# EAGLE schematic 68EC020TK-V02 (EAGLE 6.6.0)

## Sheet 1 of 4
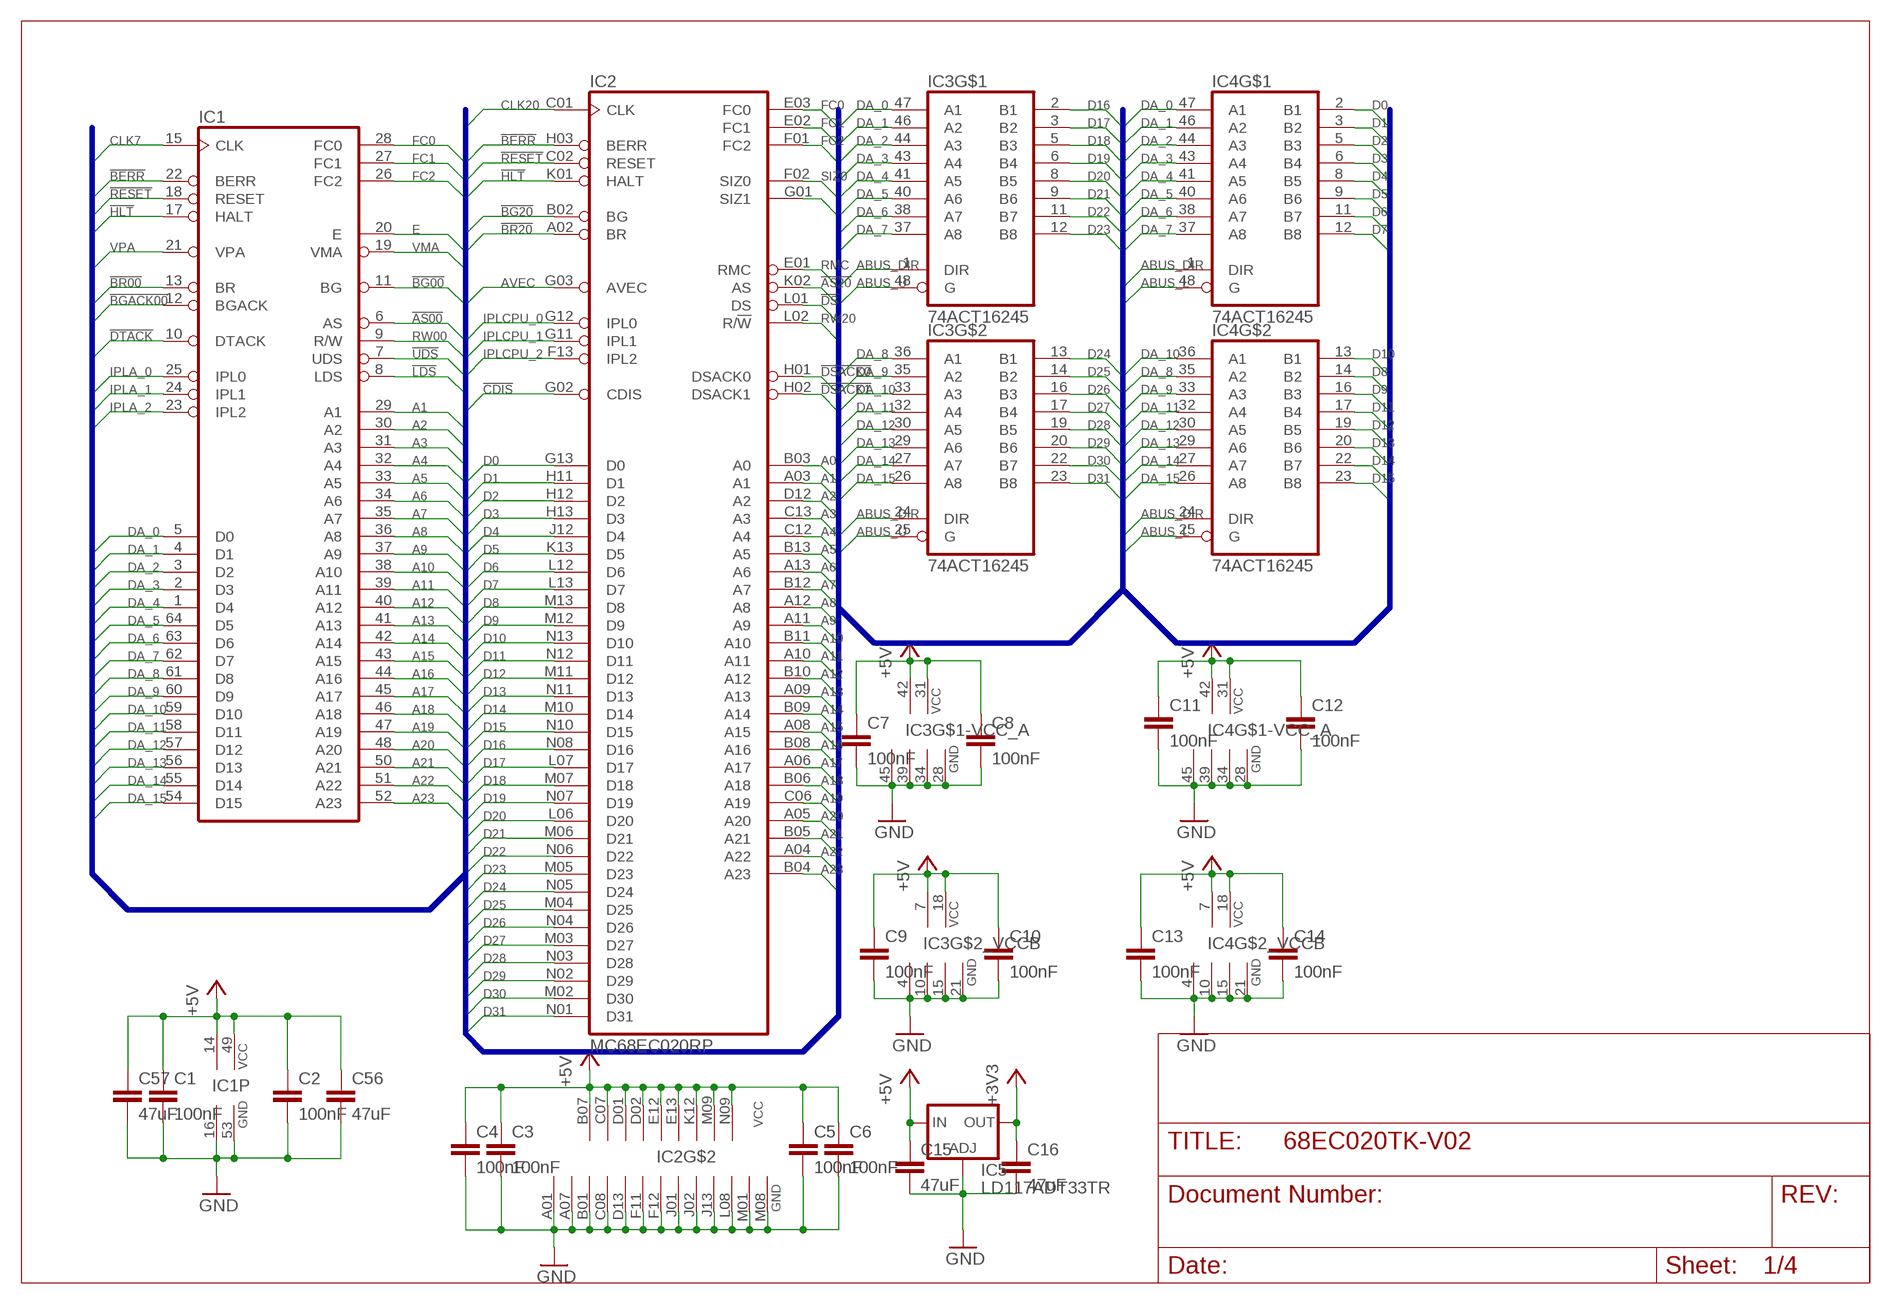
[diagram p0: schematic, sheet 1]

### Parts
C1  100nF  C-EUC0603K  [C0603K]
C2  100nF  C-EUC0603K  [C0603K]
C3  100nF  C-EUC0603K  [C0603K]
C4  100nF  C-EUC0603K  [C0603K]
C5  100nF  C-EUC0603K  [C0603K]
C6  100nF  C-EUC0603K  [C0603K]
C7  100nF  C-EUC0603K  [C0603K]
C8  100nF  C-EUC0603K  [C0603K]
C9  100nF  C-EUC0603K  [C0603K]
C10  100nF  C-EUC0603K  [C0603K]
C11  100nF  C-EUC0603K  [C0603K]
C12  100nF  C-EUC0603K  [C0603K]
C13  100nF  C-EUC0603K  [C0603K]
C14  100nF  C-EUC0603K  [C0603K]
C15  47uF  C-EUC1206K  [C1206K]
C16  47uF  C-EUC1206K  [C1206K]
C56  47uF  C-EUC1206K  [C1206K]
C57  47uF  C-EUC1206K  [C1206K]
IC1  MC68000PROUND-PADS  [DIL64-ROUND]
IC2  MC68EC020RP  [MPGA114EC]
IC3  74ACT16245  [TSSOP48]
IC4  74ACT16245  [TSSOP48]
IC5  LD117ADT33TR  [DPACK]

### Nets
!AS00: IC1.6(AS) ; also sheet 4
!AS20: IC2.K02(AS) ; also sheet 4
!BERR: IC1.22(BERR) IC2.H03(BERR) ; also sheet 4
!BG00: IC1.11(BG) ; also sheet 4
!BG20: IC2.B02(BG) ; also sheet 4
!BGACK00: IC1.12(BGACK) ; also sheet 4
!BR00: IC1.13(BR) ; also sheet 4
!BR20: IC2.A02(BR) ; also sheet 4
!CDIS: IC2.G02(CDIS) ; also sheet 4
!DS: IC2.L01(DS) ; also sheet 4
!DSACK0: IC2.H01(DSACK0) ; also sheet 4
!DSACK1: IC2.H02(DSACK1) ; also sheet 4
!DTACK: IC1.10(DTACK) ; also sheet 4
!HLT: IC1.17(HALT) IC2.K01(HALT)
!LDS: IC1.8(LDS) ; also sheet 4
!RESET: IC1.18(RESET) IC2.C02(RESET) ; also sheet 4
!UDS: IC1.7(UDS) ; also sheet 4
+3V3: C16.1 IC5.4(OUT) ; also sheet 2,4
+5V: C1.1 C2.1 C3.1 C4.1 C5.1 C6.1 C7.1 C8.1 C9.1 C10.1 C11.1 C12.1 C13.1 C14.1 C15.1 C56.1 C57.1 IC1.14(VCC) IC1.49(VCC) IC2.B07(VCC) IC2.C07(VCC) IC2.D01(VCC) IC2.D02(VCC) IC2.E12(VCC) IC2.E13(VCC) IC2.K12(VCC) IC2.M09(VCC) IC2.N09(VCC) IC3.7(G$2_VCCB:VCC) IC3.18(G$2_VCCB:VCC) IC3.31(G$1-VCC_A:VCC) IC3.42(G$1-VCC_A:VCC) IC4.7(G$2_VCCB:VCC) IC4.18(G$2_VCCB:VCC) IC4.31(G$1-VCC_A:VCC) IC4.42(G$1-VCC_A:VCC) IC5.3(IN) ; also sheet 3,4
A0: IC2.B03(A0) ; also sheet 4
A1: IC1.29(A1) IC2.A03(A1) ; also sheet 3,4
A2: IC1.30(A2) IC2.D12(A2) ; also sheet 3,4
A3: IC1.31(A3) IC2.C13(A3) ; also sheet 3,4
A4: IC1.32(A4) IC2.C12(A4) ; also sheet 3,4
A5: IC1.33(A5) IC2.B13(A5) ; also sheet 3,4
A6: IC1.34(A6) IC2.A13(A6) ; also sheet 3,4
A7: IC1.35(A7) IC2.B12(A7) ; also sheet 3,4
A8: IC1.36(A8) IC2.A12(A8) ; also sheet 3,4
A9: IC1.37(A9) IC2.A11(A9) ; also sheet 3,4
A10: IC1.38(A10) IC2.B11(A10) ; also sheet 3,4
A11: IC1.39(A11) IC2.A10(A11) ; also sheet 3,4
A12: IC1.40(A12) IC2.B10(A12) ; also sheet 3,4
A13: IC1.41(A13) IC2.A09(A13) ; also sheet 3,4
A14: IC1.42(A14) IC2.B09(A14) ; also sheet 3,4
A15: IC1.43(A15) IC2.A08(A15) ; also sheet 3,4
A16: IC1.44(A16) IC2.B08(A16) ; also sheet 3,4
A17: IC1.45(A17) IC2.A06(A17) ; also sheet 3,4
A18: IC1.46(A18) IC2.B06(A18) ; also sheet 4
A19: IC1.47(A19) IC2.C06(A19) ; also sheet 4
A20: IC1.48(A20) IC2.A05(A20) ; also sheet 4
A21: IC1.50(A21) IC2.B05(A21) ; also sheet 4
A22: IC1.51(A22) IC2.A04(A22) ; also sheet 4
A23: IC1.52(A23) IC2.B04(A23) ; also sheet 4
ABUS_DIR: IC3.1(DIR) IC3.24(DIR) IC4.1(DIR) IC4.24(DIR) ; also sheet 4
ABUS_L: IC4.25(G) IC4.48(G) ; also sheet 4
ABUS_U: IC3.25(G) IC3.48(G) ; also sheet 4
AVEC: IC2.G03(AVEC) ; also sheet 4
CLK7: IC1.15(CLK) ; also sheet 4
CLK20: IC2.C01(CLK) ; also sheet 4
D0: IC2.G13(D0) IC4.2(B1) ; also sheet 2
D1: IC2.H11(D1) IC4.3(B2) ; also sheet 2
D2: IC2.H12(D2) IC4.5(B3) ; also sheet 2
D3: IC2.H13(D3) IC4.6(B4) ; also sheet 2
D4: IC2.J12(D4) IC4.8(B5) ; also sheet 2
D5: IC2.K13(D5) IC4.9(B6) ; also sheet 2
D6: IC2.L12(D6) IC4.11(B7) ; also sheet 2
D7: IC2.L13(D7) IC4.12(B8) ; also sheet 2
D8: IC2.M13(D8) IC4.14(B2) ; also sheet 2
D9: IC2.M12(D9) IC4.16(B3) ; also sheet 2
D10: IC2.N13(D10) IC4.13(B1) ; also sheet 2
D11: IC2.N12(D11) IC4.17(B4) ; also sheet 2
D12: IC2.M11(D12) IC4.19(B5) ; also sheet 2
D13: IC2.N11(D13) IC4.20(B6) ; also sheet 2
D14: IC2.M10(D14) IC4.22(B7) ; also sheet 2
D15: IC2.N10(D15) IC4.23(B8) ; also sheet 2
D16: IC2.N08(D16) IC3.2(B1) ; also sheet 2,3
D17: IC2.L07(D17) IC3.3(B2) ; also sheet 2,3
D18: IC2.M07(D18) IC3.5(B3) ; also sheet 2,3
D19: IC2.N07(D19) IC3.6(B4) ; also sheet 2,3
D20: IC2.L06(D20) IC3.8(B5) ; also sheet 2,3
D21: IC2.M06(D21) IC3.9(B6) ; also sheet 2,3
D22: IC2.N06(D22) IC3.11(B7) ; also sheet 2,3
D23: IC2.M05(D23) IC3.12(B8) ; also sheet 2,3
D24: IC2.N05(D24) IC3.13(B1) ; also sheet 2,3
D25: IC2.M04(D25) IC3.14(B2) ; also sheet 2,3
D26: IC2.N04(D26) IC3.16(B3) ; also sheet 2,3
D27: IC2.M03(D27) IC3.17(B4) ; also sheet 2,3
D28: IC2.N03(D28) IC3.19(B5) ; also sheet 2,3,4
D29: IC2.N02(D29) IC3.20(B6) ; also sheet 2,3,4
D30: IC2.M02(D30) IC3.22(B7) ; also sheet 2,3,4
D31: IC2.N01(D31) IC3.23(B8) ; also sheet 2,3,4
DA_0: IC1.5(D0) IC3.47(A1) IC4.47(A1)
DA_1: IC1.4(D1) IC3.46(A2) IC4.46(A2)
DA_2: IC1.3(D2) IC3.44(A3) IC4.44(A3)
DA_3: IC1.2(D3) IC3.43(A4) IC4.43(A4)
DA_4: IC1.1(D4) IC3.41(A5) IC4.41(A5)
DA_5: IC1.64(D5) IC3.40(A6) IC4.40(A6)
DA_6: IC1.63(D6) IC3.38(A7) IC4.38(A7)
DA_7: IC1.62(D7) IC3.37(A8) IC4.37(A8)
DA_8: IC1.61(D8) IC3.36(A1) IC4.35(A2)
DA_9: IC1.60(D9) IC3.35(A2) IC4.33(A3)
DA_10: IC1.59(D10) IC3.33(A3) IC4.36(A1)
DA_11: IC1.58(D11) IC3.32(A4) IC4.32(A4)
DA_12: IC1.57(D12) IC3.30(A5) IC4.30(A5)
DA_13: IC1.56(D13) IC3.29(A6) IC4.29(A6)
DA_14: IC1.55(D14) IC3.27(A7) IC4.27(A7)
DA_15: IC1.54(D15) IC3.26(A8) IC4.26(A8)
E: IC1.20(E) ; also sheet 4
FC0: IC1.28(FC0) IC2.E03(FC0) ; also sheet 4
FC1: IC1.27(FC1) IC2.E02(FC1) ; also sheet 4
FC2: IC1.26(FC2) IC2.F01(FC2)
GND: C1.2 C2.2 C3.2 C4.2 C5.2 C6.2 C7.2 C8.2 C9.2 C10.2 C11.2 C12.2 C13.2 C14.2 C15.2 C16.2 C56.2 C57.2 IC1.16(GND) IC1.53(GND) IC2.A01(GND) IC2.A07(GND) IC2.B01(GND) IC2.C08(GND) IC2.D13(GND) IC2.F11(GND) IC2.F12(GND) IC2.J01(GND) IC2.J02(GND) IC2.J13(GND) IC2.L08(GND) IC2.M01(GND) IC2.M08(GND) IC3.4(G$2_VCCB:GND) IC3.10(G$2_VCCB:GND) IC3.15(G$2_VCCB:GND) IC3.21(G$2_VCCB:GND) IC3.28(G$1-VCC_A:GND) IC3.34(G$1-VCC_A:GND) IC3.39(G$1-VCC_A:GND) IC3.45(G$1-VCC_A:GND) IC4.4(G$2_VCCB:GND) IC4.10(G$2_VCCB:GND) IC4.15(G$2_VCCB:GND) IC4.21(G$2_VCCB:GND) IC4.28(G$1-VCC_A:GND) IC4.34(G$1-VCC_A:GND) IC4.39(G$1-VCC_A:GND) IC4.45(G$1-VCC_A:GND) IC5.1(ADJ) ; also sheet 2,3,4
IPLA_0: IC1.25(IPL0) ; also sheet 4
IPLA_1: IC1.24(IPL1) ; also sheet 4
IPLA_2: IC1.23(IPL2) ; also sheet 4
IPLCPU_0: IC2.G12(IPL0) ; also sheet 4
IPLCPU_1: IC2.G11(IPL1) ; also sheet 4
IPLCPU_2: IC2.F13(IPL2) ; also sheet 4
RMC: IC2.E01(RMC) ; also sheet 4
RW00: IC1.9(R/W) ; also sheet 4
RW20: IC2.L02(R/!W) ; also sheet 4
SIZ0: IC2.F02(SIZ0) ; also sheet 4
SIZ1: IC2.G01(SIZ1) ; also sheet 4
VMA: IC1.19(VMA) ; also sheet 4
VPA: IC1.21(VPA) ; also sheet 4

### Buses
A[0..23],DA_[0..15],D[0..31],IPLA_[0..2],IPLCPU_[0..2],FC[0..2],!RESET,!BR00,!BG00,!BGACK00,!BR20,!BG20,!DTACK,!DS,!DSACK[0..1],!AS00,!AS20,RW00,RW20,!UDS,!LDS,SIZ[0..1],E,VMA,VPA,!CDIS,CLK7,CLK20,!BERR,!HLT,AVEC,RMC,ABUS_DIR,ABUS_U,ABUS_L

## Sheet 2 of 4
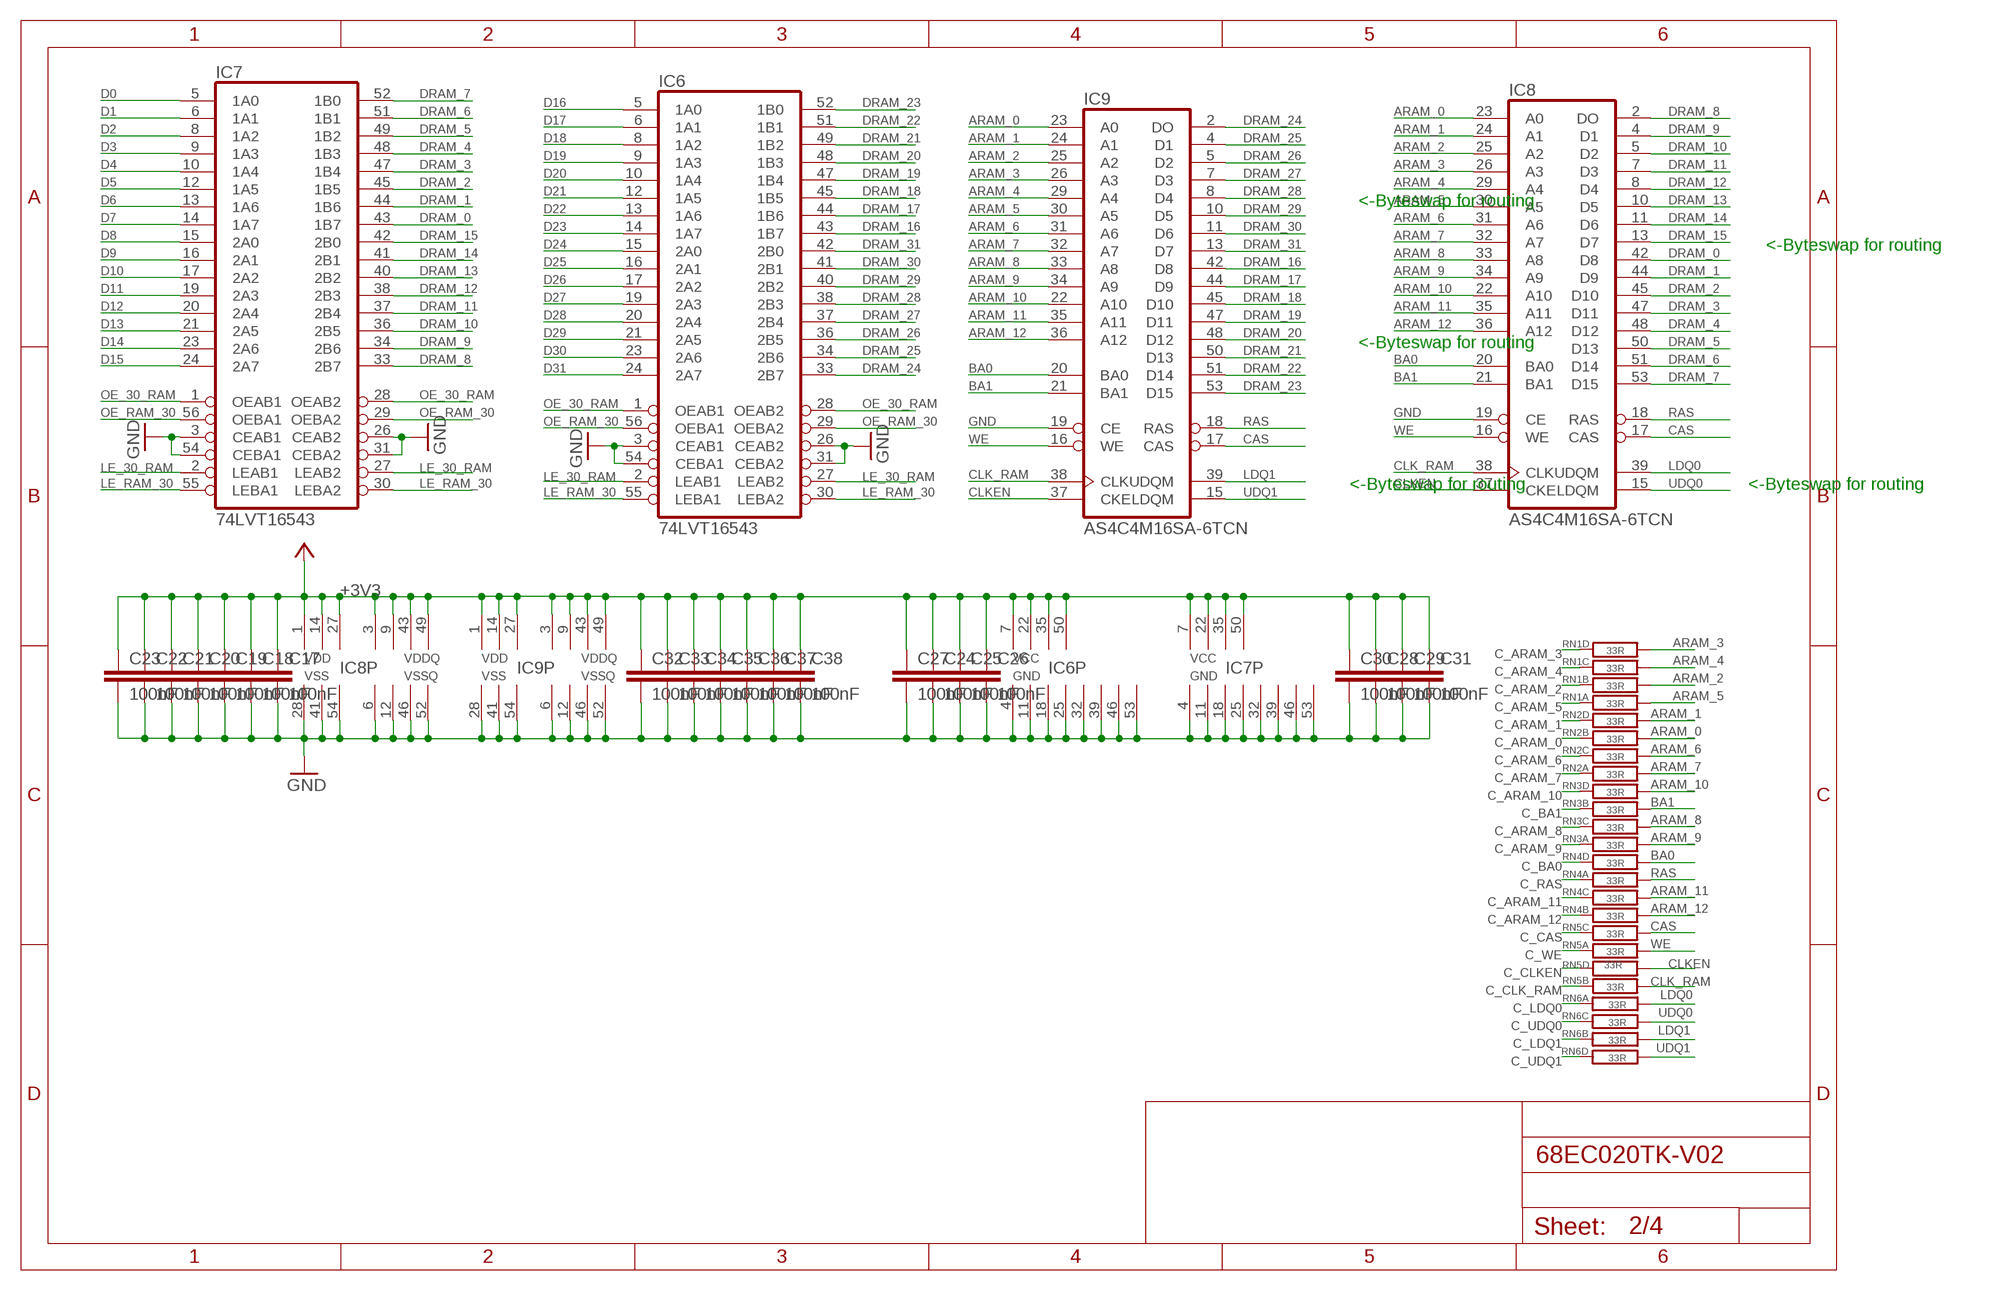
[diagram p1: schematic, sheet 2]

### Parts
C17  100nF  C-EUC0603K  [C0603K]
C18  100nF  C-EUC0603K  [C0603K]
C19  100nF  C-EUC0603K  [C0603K]
C20  100nF  C-EUC0603K  [C0603K]
C21  100nF  C-EUC0603K  [C0603K]
C22  100nF  C-EUC0603K  [C0603K]
C23  100nF  C-EUC0603K  [C0603K]
C24  100nF  C-EUC0603K  [C0603K]
C25  100nF  C-EUC0603K  [C0603K]
C26  100nF  C-EUC0603K  [C0603K]
C27  100nF  C-EUC0603K  [C0603K]
C28  100nF  C-EUC0603K  [C0603K]
C29  100nF  C-EUC0603K  [C0603K]
C30  100nF  C-EUC0603K  [C0603K]
C31  100nF  C-EUC0603K  [C0603K]
C32  100nF  C-EUC0603K  [C0603K]
C33  100nF  C-EUC0603K  [C0603K]
C34  100nF  C-EUC0603K  [C0603K]
C35  100nF  C-EUC0603K  [C0603K]
C36  100nF  C-EUC0603K  [C0603K]
C37  100nF  C-EUC0603K  [C0603K]
C38  100nF  C-EUC0603K  [C0603K]
IC6  74LVT16543  ABT16543@2  [TSSOP56@2]
IC7  74LVT16543  ABT16543@2  [TSSOP56@2]
IC8  AS4C4M16SA-6TCN  K4S56163@2  [TSOP2-54@2]
IC9  AS4C4M16SA-6TCN  K4S56163@2  [TSOP2-54@2]
RN1  33R  R-NETZ@3  [R-NETZ@2]
RN2  33R  R-NETZ@3  [R-NETZ@2]
RN3  33R  R-NETZ@3  [R-NETZ@2]
RN4  33R  R-NETZ@3  [R-NETZ@2]
RN5  33R  R-NETZ@3  [R-NETZ@2]
RN6  33R  R-NETZ@3  [R-NETZ@2]

### Nets
+3V3: C17.1 C18.1 C19.1 C20.1 C21.1 C22.1 C23.1 C24.1 C25.1 C26.1 C27.1 C28.1 C29.1 C30.1 C31.1 C32.1 C33.1 C34.1 C35.1 C36.1 C37.1 C38.1 IC6.7(VCC) IC6.22(VCC) IC6.35(VCC) IC6.50(VCC) IC7.7(VCC) IC7.22(VCC) IC7.35(VCC) IC7.50(VCC) IC8.1(VCC) IC8.3(VCC) IC8.9(VCC) IC8.14(VCC) IC8.27(VCC) IC8.43(VCC) IC8.49(VCC) IC9.1(VCC) IC9.3(VCC) IC9.9(VCC) IC9.14(VCC) IC9.27(VCC) IC9.43(VCC) IC9.49(VCC) ; supply symbol labelled 3,3V ; also sheet 1,4
ARAM_0: IC8.23(A0) IC9.23(A0) RN2.P$2
ARAM_1: IC8.24(A1) IC9.24(A1) RN2.P$4
ARAM_2: IC8.25(A2) IC9.25(A2) RN1.P$2
ARAM_3: IC8.26(A3) IC9.26(A3) RN1.P$4
ARAM_4: IC8.29(A4) IC9.29(A4) RN1.P$3
ARAM_5: IC8.30(A5) IC9.30(A5) RN1.P$1
ARAM_6: IC8.31(A6) IC9.31(A6) RN2.P$3
ARAM_7: IC8.32(A7) IC9.32(A7) RN2.P$1
ARAM_8: IC8.33(A8) IC9.33(A8) RN3.P$3
ARAM_9: IC8.34(A9) IC9.34(A9) RN3.P$1
ARAM_10: IC8.22(A10) IC9.22(A10) RN3.P$4
ARAM_11: IC8.35(A11) IC9.35(A11) RN4.P$3
ARAM_12: IC8.36(A12) IC9.36(A12) RN4.P$2
BA0: IC8.20(BA0) IC9.20(BA0) RN4.P$4
BA1: IC8.21(BA1) IC9.21(BA1) RN3.P$2
C_ARAM_0: RN2.P$7 ; also sheet 4
C_ARAM_1: RN2.P$5 ; also sheet 4
C_ARAM_2: RN1.P$7 ; also sheet 4
C_ARAM_3: RN1.P$5 ; also sheet 4
C_ARAM_4: RN1.P$6 ; also sheet 4
C_ARAM_5: RN1.P$8 ; also sheet 4
C_ARAM_6: RN2.P$6 ; also sheet 4
C_ARAM_7: RN2.P$8 ; also sheet 4
C_ARAM_8: RN3.P$6 ; also sheet 4
C_ARAM_9: RN3.P$8 ; also sheet 4
C_ARAM_10: RN3.P$5 ; also sheet 4
C_ARAM_11: RN4.P$6 ; also sheet 4
C_ARAM_12: RN4.P$7 ; also sheet 4
C_BA0: RN4.P$5 ; also sheet 4
C_BA1: RN3.P$7 ; also sheet 4
C_CAS: RN5.P$6 ; also sheet 4
C_CLK_RAM: RN5.P$7 ; also sheet 4
C_CLKEN: RN5.P$5 ; also sheet 4
C_LDQ0: RN6.P$1 ; also sheet 4
C_LDQ1: RN6.P$2 ; also sheet 4
C_RAS: RN4.P$8 ; also sheet 4
C_UDQ0: RN6.P$3 ; also sheet 4
C_UDQ1: RN6.P$4 ; also sheet 4
C_WE: RN5.P$8 ; also sheet 4
CAS: IC8.17(CAS) IC9.17(CAS) RN5.P$3
CLK_RAM: IC8.38(CLK) IC9.38(CLK) RN5.P$2
CLKEN: IC8.37(CKE) IC9.37(CKE) RN5.P$4
D0: IC7.5(1A0) ; also sheet 1
D1: IC7.6(1A1) ; also sheet 1
D2: IC7.8(1A2) ; also sheet 1
D3: IC7.9(1A3) ; also sheet 1
D4: IC7.10(1A4) ; also sheet 1
D5: IC7.12(1A5) ; also sheet 1
D6: IC7.13(1A6) ; also sheet 1
D7: IC7.14(1A7) ; also sheet 1
D8: IC7.15(2A0) ; also sheet 1
D9: IC7.16(2A1) ; also sheet 1
D10: IC7.17(2A2) ; also sheet 1
D11: IC7.19(2A3) ; also sheet 1
D12: IC7.20(2A4) ; also sheet 1
D13: IC7.21(2A5) ; also sheet 1
D14: IC7.23(2A6) ; also sheet 1
D15: IC7.24(2A7) ; also sheet 1
D16: IC6.5(1A0) ; also sheet 1,3
D17: IC6.6(1A1) ; also sheet 1,3
D18: IC6.8(1A2) ; also sheet 1,3
D19: IC6.9(1A3) ; also sheet 1,3
D20: IC6.10(1A4) ; also sheet 1,3
D21: IC6.12(1A5) ; also sheet 1,3
D22: IC6.13(1A6) ; also sheet 1,3
D23: IC6.14(1A7) ; also sheet 1,3
D24: IC6.15(2A0) ; also sheet 1,3
D25: IC6.16(2A1) ; also sheet 1,3
D26: IC6.17(2A2) ; also sheet 1,3
D27: IC6.19(2A3) ; also sheet 1,3
D28: IC6.20(2A4) ; also sheet 1,3,4
D29: IC6.21(2A5) ; also sheet 1,3,4
D30: IC6.23(2A6) ; also sheet 1,3,4
D31: IC6.24(2A7) ; also sheet 1,3,4
DRAM_0: IC7.43(1B7) IC8.42(D8)
DRAM_1: IC7.44(1B6) IC8.44(D9)
DRAM_2: IC7.45(1B5) IC8.45(D10)
DRAM_3: IC7.47(1B4) IC8.47(D11)
DRAM_4: IC7.48(1B3) IC8.48(D12)
DRAM_5: IC7.49(1B2) IC8.50(D13)
DRAM_6: IC7.51(1B1) IC8.51(D14)
DRAM_7: IC7.52(1B0) IC8.53(D15)
DRAM_8: IC7.33(2B7) IC8.2(DO)
DRAM_9: IC7.34(2B6) IC8.4(D1)
DRAM_10: IC7.36(2B5) IC8.5(D2)
DRAM_11: IC7.37(2B4) IC8.7(D3)
DRAM_12: IC7.38(2B3) IC8.8(D4)
DRAM_13: IC7.40(2B2) IC8.10(D5)
DRAM_14: IC7.41(2B1) IC8.11(D6)
DRAM_15: IC7.42(2B0) IC8.13(D7)
DRAM_16: IC6.43(1B7) IC9.42(D8)
DRAM_17: IC6.44(1B6) IC9.44(D9)
DRAM_18: IC6.45(1B5) IC9.45(D10)
DRAM_19: IC6.47(1B4) IC9.47(D11)
DRAM_20: IC6.48(1B3) IC9.48(D12)
DRAM_21: IC6.49(1B2) IC9.50(D13)
DRAM_22: IC6.51(1B1) IC9.51(D14)
DRAM_23: IC6.52(1B0) IC9.53(D15)
DRAM_24: IC6.33(2B7) IC9.2(DO)
DRAM_25: IC6.34(2B6) IC9.4(D1)
DRAM_26: IC6.36(2B5) IC9.5(D2)
DRAM_27: IC6.37(2B4) IC9.7(D3)
DRAM_28: IC6.38(2B3) IC9.8(D4)
DRAM_29: IC6.40(2B2) IC9.10(D5)
DRAM_30: IC6.41(2B1) IC9.11(D6)
DRAM_31: IC6.42(2B0) IC9.13(D7)
GND: C17.2 C18.2 C19.2 C20.2 C21.2 C22.2 C23.2 C24.2 C25.2 C26.2 C27.2 C28.2 C29.2 C30.2 C31.2 C32.2 C33.2 C34.2 C35.2 C36.2 C37.2 C38.2 IC6.3(CEAB1) IC6.4(GND) IC6.11(GND) IC6.18(GND) IC6.25(GND) IC6.26(CEAB2) IC6.31(CEBA2) IC6.32(GND) IC6.39(GND) IC6.46(GND) IC6.53(GND) IC6.54(CEBA1) IC7.3(CEAB1) IC7.4(GND) IC7.11(GND) IC7.18(GND) IC7.25(GND) IC7.26(CEAB2) IC7.31(CEBA2) IC7.32(GND) IC7.39(GND) IC7.46(GND) IC7.53(GND) IC7.54(CEBA1) IC8.6(GND) IC8.12(GND) IC8.19(CE) IC8.28(GND) IC8.41(GND) IC8.46(GND) IC8.52(GND) IC8.54(GND) IC9.6(GND) IC9.12(GND) IC9.19(CE) IC9.28(GND) IC9.41(GND) IC9.46(GND) IC9.52(GND) IC9.54(GND) ; also sheet 1,3,4
LDQ0: IC8.39(UDQM) RN6.P$8
LDQ1: IC9.39(UDQM) RN6.P$7
LE_30_RAM: IC6.2(LEAB1) IC6.27(LEAB2) IC7.2(LEAB1) IC7.27(LEAB2) ; also sheet 4
LE_RAM_30: IC6.30(LEBA2) IC6.55(LEBA1) IC7.30(LEBA2) IC7.55(LEBA1) ; also sheet 4
OE_30_RAM: IC6.1(OEAB1) IC6.28(OEAB2) IC7.1(OEAB1) IC7.28(OEAB2) ; also sheet 4
OE_RAM_30: IC6.29(OEBA2) IC6.56(OEBA1) IC7.29(OEBA2) IC7.56(OEBA1) ; also sheet 4
RAS: IC8.18(RAS) IC9.18(RAS) RN4.P$1
UDQ0: IC8.15(LDQM) RN6.P$6
UDQ1: IC9.15(LDQM) RN6.P$5
WE: IC8.16(WE) IC9.16(WE) RN5.P$1

### Notes on the sheet
- <-Byteswap for routing
- <-Byteswap for routing
- <-Byteswap for routing
- <-Byteswap for routing | <-Byteswap for routing

## Sheet 3 of 4
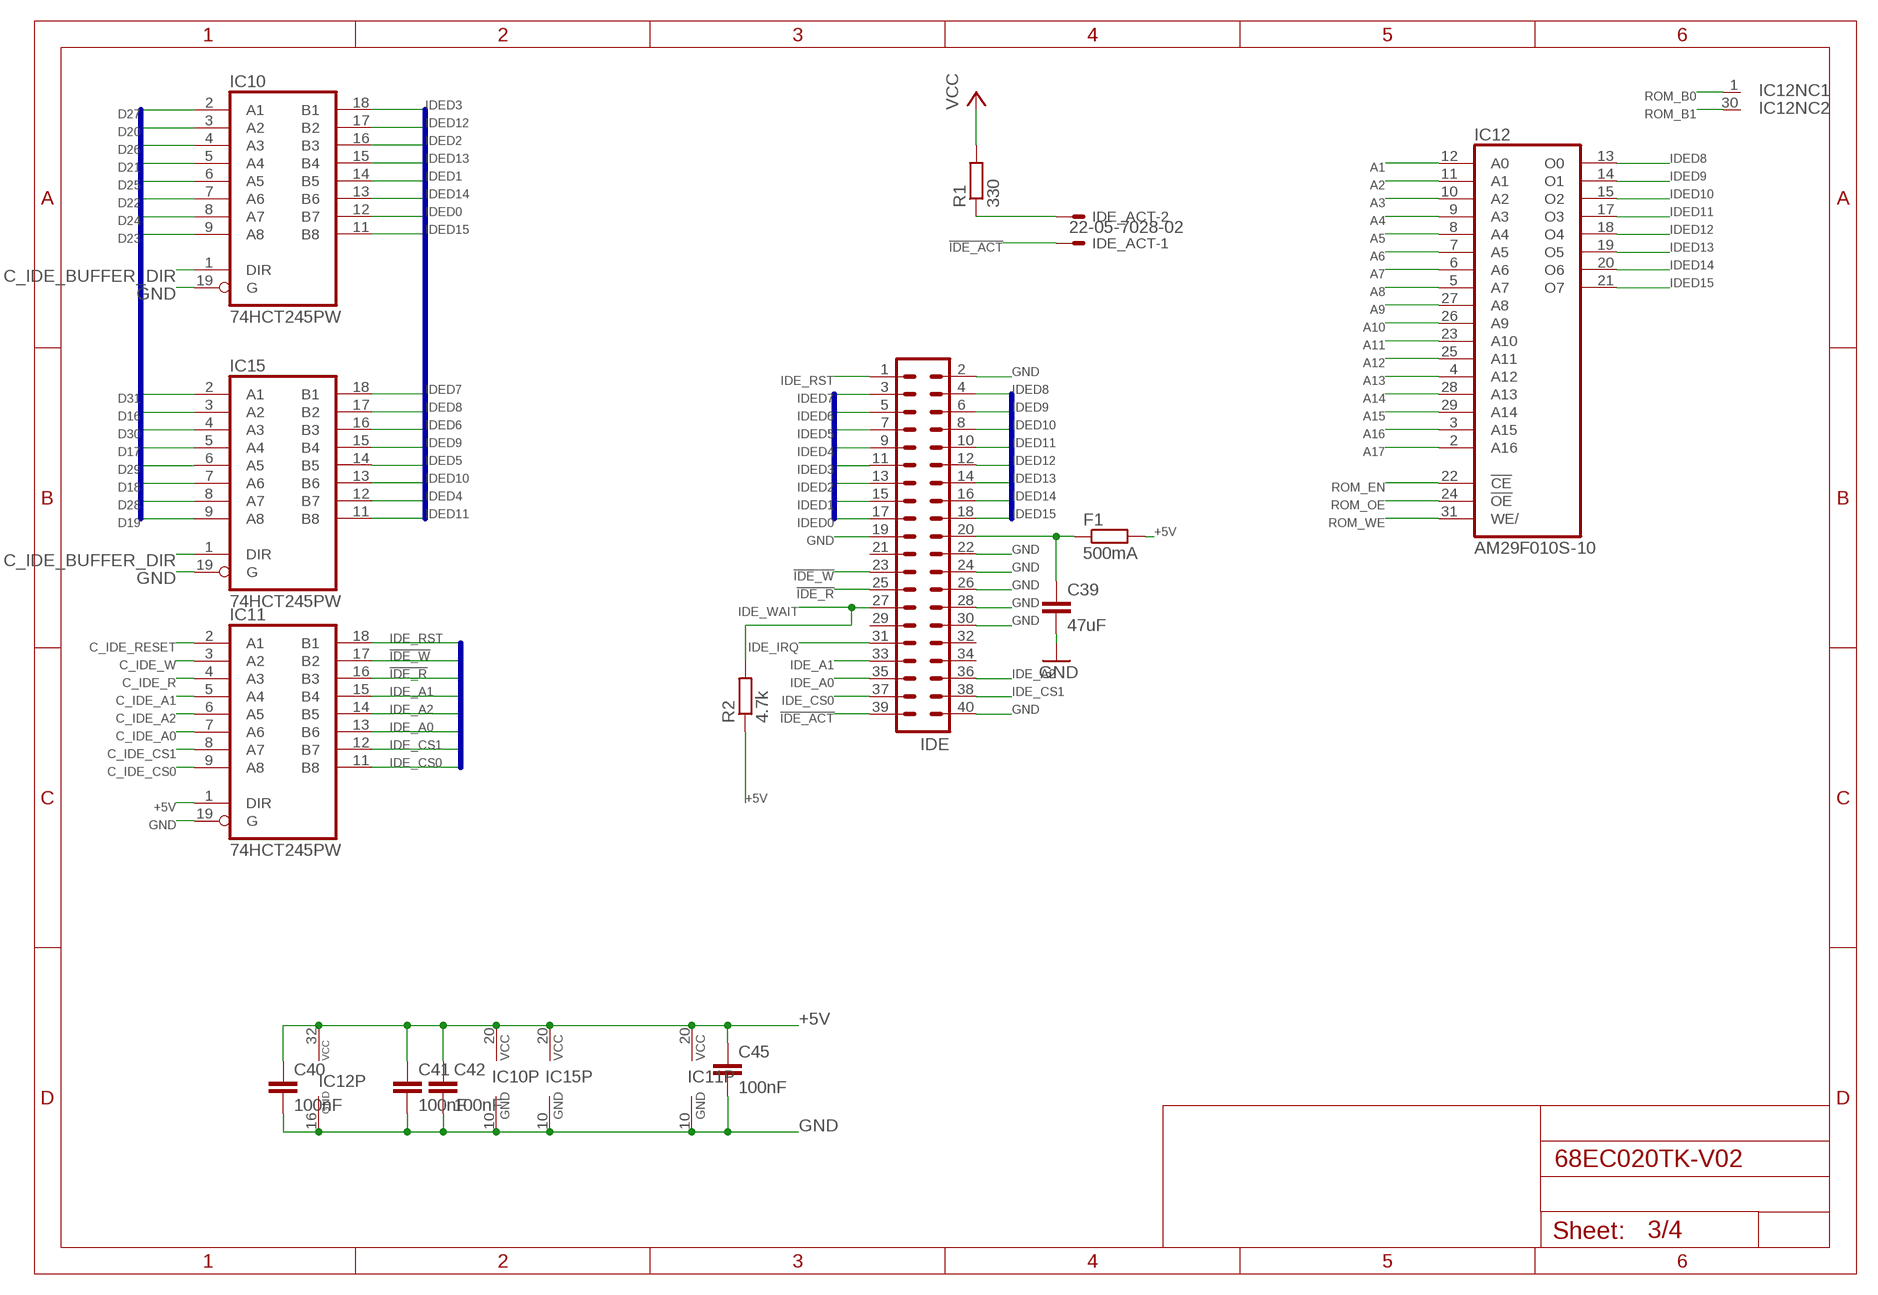
[diagram p2: schematic, sheet 3]

### Parts
C39  47uF  C-EUC1206K  [C1206K]
C40  100nF  C-EUC0603K  [C0603K]
C41  100nF  C-EUC0603K  [C0603K]
C42  100nF  C-EUC0603K  [C0603K]
C45  100nF  C-EUC0603K  [C0603K]
F1  500mA  R-EU_R2512  [R2512]
IC10  74HCT245PW  [TSSOP20]
IC11  74HCT245PW  [TSSOP20]
IC12  AM29F010S-10  AM29F010S  [PLCC-SR32]
IC15  74HCT245PW  [TSSOP20]
IDE  ML40  [ML40]
IDE_ACT  22-05-7028-02  [7395-02]
R1  330  R-EU_R0603  [R0603]
R2  4.7k  R-EU_R0603  [R0603]

### Nets
!IDE_ACT: IDE.39 IDE_ACT.1
!IDE_R: IC11.16(B3) IDE.25
!IDE_W: IC11.17(B2) IDE.23
+5V: C40.1 C41.1 C42.1 C45.1 F1.2 IC10.20(VCC) IC11.1(DIR) IC11.20(VCC) IC12.32(VCC) IC15.20(VCC) R1.2 R2.1 ; supply symbol labelled VCC ; also sheet 1,4
A1: IC12.12(A0) ; also sheet 1,4
A2: IC12.11(A1) ; also sheet 1,4
A3: IC12.10(A2) ; also sheet 1,4
A4: IC12.9(A3) ; also sheet 1,4
A5: IC12.8(A4) ; also sheet 1,4
A6: IC12.7(A5) ; also sheet 1,4
A7: IC12.6(A6) ; also sheet 1,4
A8: IC12.5(A7) ; also sheet 1,4
A9: IC12.27(A8) ; also sheet 1,4
A10: IC12.26(A9) ; also sheet 1,4
A11: IC12.23(A10) ; also sheet 1,4
A12: IC12.25(A11) ; also sheet 1,4
A13: IC12.4(A12) ; also sheet 1,4
A14: IC12.28(A13) ; also sheet 1,4
A15: IC12.29(A14) ; also sheet 1,4
A16: IC12.3(A15) ; also sheet 1,4
A17: IC12.2(A16) ; also sheet 1,4
C_IDE_A0: IC11.7(A6) ; also sheet 4
C_IDE_A1: IC11.5(A4) ; also sheet 4
C_IDE_A2: IC11.6(A5) ; also sheet 4
C_IDE_BUFFER_DIR: IC10.1(DIR) IC15.1(DIR) ; also sheet 4
C_IDE_CS0: IC11.9(A8) ; also sheet 4
C_IDE_CS1: IC11.8(A7) ; also sheet 4
C_IDE_R: IC11.4(A3) ; also sheet 4
C_IDE_RESET: IC11.2(A1) ; also sheet 4
C_IDE_W: IC11.3(A2) ; also sheet 4
D16: IC15.3(A2) ; also sheet 1,2
D17: IC15.5(A4) ; also sheet 1,2
D18: IC15.7(A6) ; also sheet 1,2
D19: IC15.9(A8) ; also sheet 1,2
D20: IC10.3(A2) ; also sheet 1,2
D21: IC10.5(A4) ; also sheet 1,2
D22: IC10.7(A6) ; also sheet 1,2
D23: IC10.9(A8) ; also sheet 1,2
D24: IC10.8(A7) ; also sheet 1,2
D25: IC10.6(A5) ; also sheet 1,2
D26: IC10.4(A3) ; also sheet 1,2
D27: IC10.2(A1) ; also sheet 1,2
D28: IC15.8(A7) ; also sheet 1,2,4
D29: IC15.6(A5) ; also sheet 1,2,4
D30: IC15.4(A3) ; also sheet 1,2,4
D31: IC15.2(A1) ; also sheet 1,2,4
GND: C39.2 C40.2 C41.2 C42.2 C45.2 IC10.10(GND) IC10.19(G) IC11.10(GND) IC11.19(G) IC12.16(GND) IC15.10(GND) IC15.19(G) IDE.2 IDE.19 IDE.22 IDE.24 IDE.26 IDE.28 IDE.30 IDE.40 ; also sheet 1,2,4
IDE_A0: IC11.13(B6) IDE.35
IDE_A1: IC11.15(B4) IDE.33
IDE_A2: IC11.14(B5) IDE.36
IDE_CS0: IC11.11(B8) IDE.37
IDE_CS1: IC11.12(B7) IDE.38
IDE_IRQ: IDE.31
IDE_RST: IC11.18(B1) IDE.1
IDE_WAIT: IDE.27 R2.2 ; also sheet 4
IDED0: IC10.12(B7) IDE.17
IDED1: IC10.14(B5) IDE.15
IDED2: IC10.16(B3) IDE.13
IDED3: IC10.18(B1) IDE.11
IDED4: IC15.12(B7) IDE.9
IDED5: IC15.14(B5) IDE.7
IDED6: IC15.16(B3) IDE.5
IDED7: IC15.18(B1) IDE.3
IDED8: IC12.13(O0) IC15.17(B2) IDE.4
IDED9: IC12.14(O1) IC15.15(B4) IDE.6
IDED10: IC12.15(O2) IC15.13(B6) IDE.8
IDED11: IC12.17(O3) IC15.11(B8) IDE.10
IDED12: IC10.17(B2) IC12.18(O4) IDE.12
IDED13: IC10.15(B4) IC12.19(O5) IDE.14
IDED14: IC10.13(B6) IC12.20(O6) IDE.16
IDED15: IC10.11(B8) IC12.21(O7) IDE.18
KEY_PIN_POWER: C39.1 F1.1 IDE.20
N$25: IDE_ACT.2 R1.1
ROM_B0: IC12.1(NC) ; also sheet 4
ROM_B1: IC12.30(NC) ; also sheet 4
ROM_EN: IC12.22(!CE) ; also sheet 4
ROM_OE: IC12.24(!OE) ; also sheet 4
ROM_WE: IC12.31(WE/) ; also sheet 4
Unconnected: IDE.21 IDE.29 IDE.32 IDE.34

### Buses
IDED[0..15]
D[0..31]
IDE_RST,IDE_A[0..2],IDE_CS[0..1],!IDE_R,!IDE_W

## Sheet 4 of 4
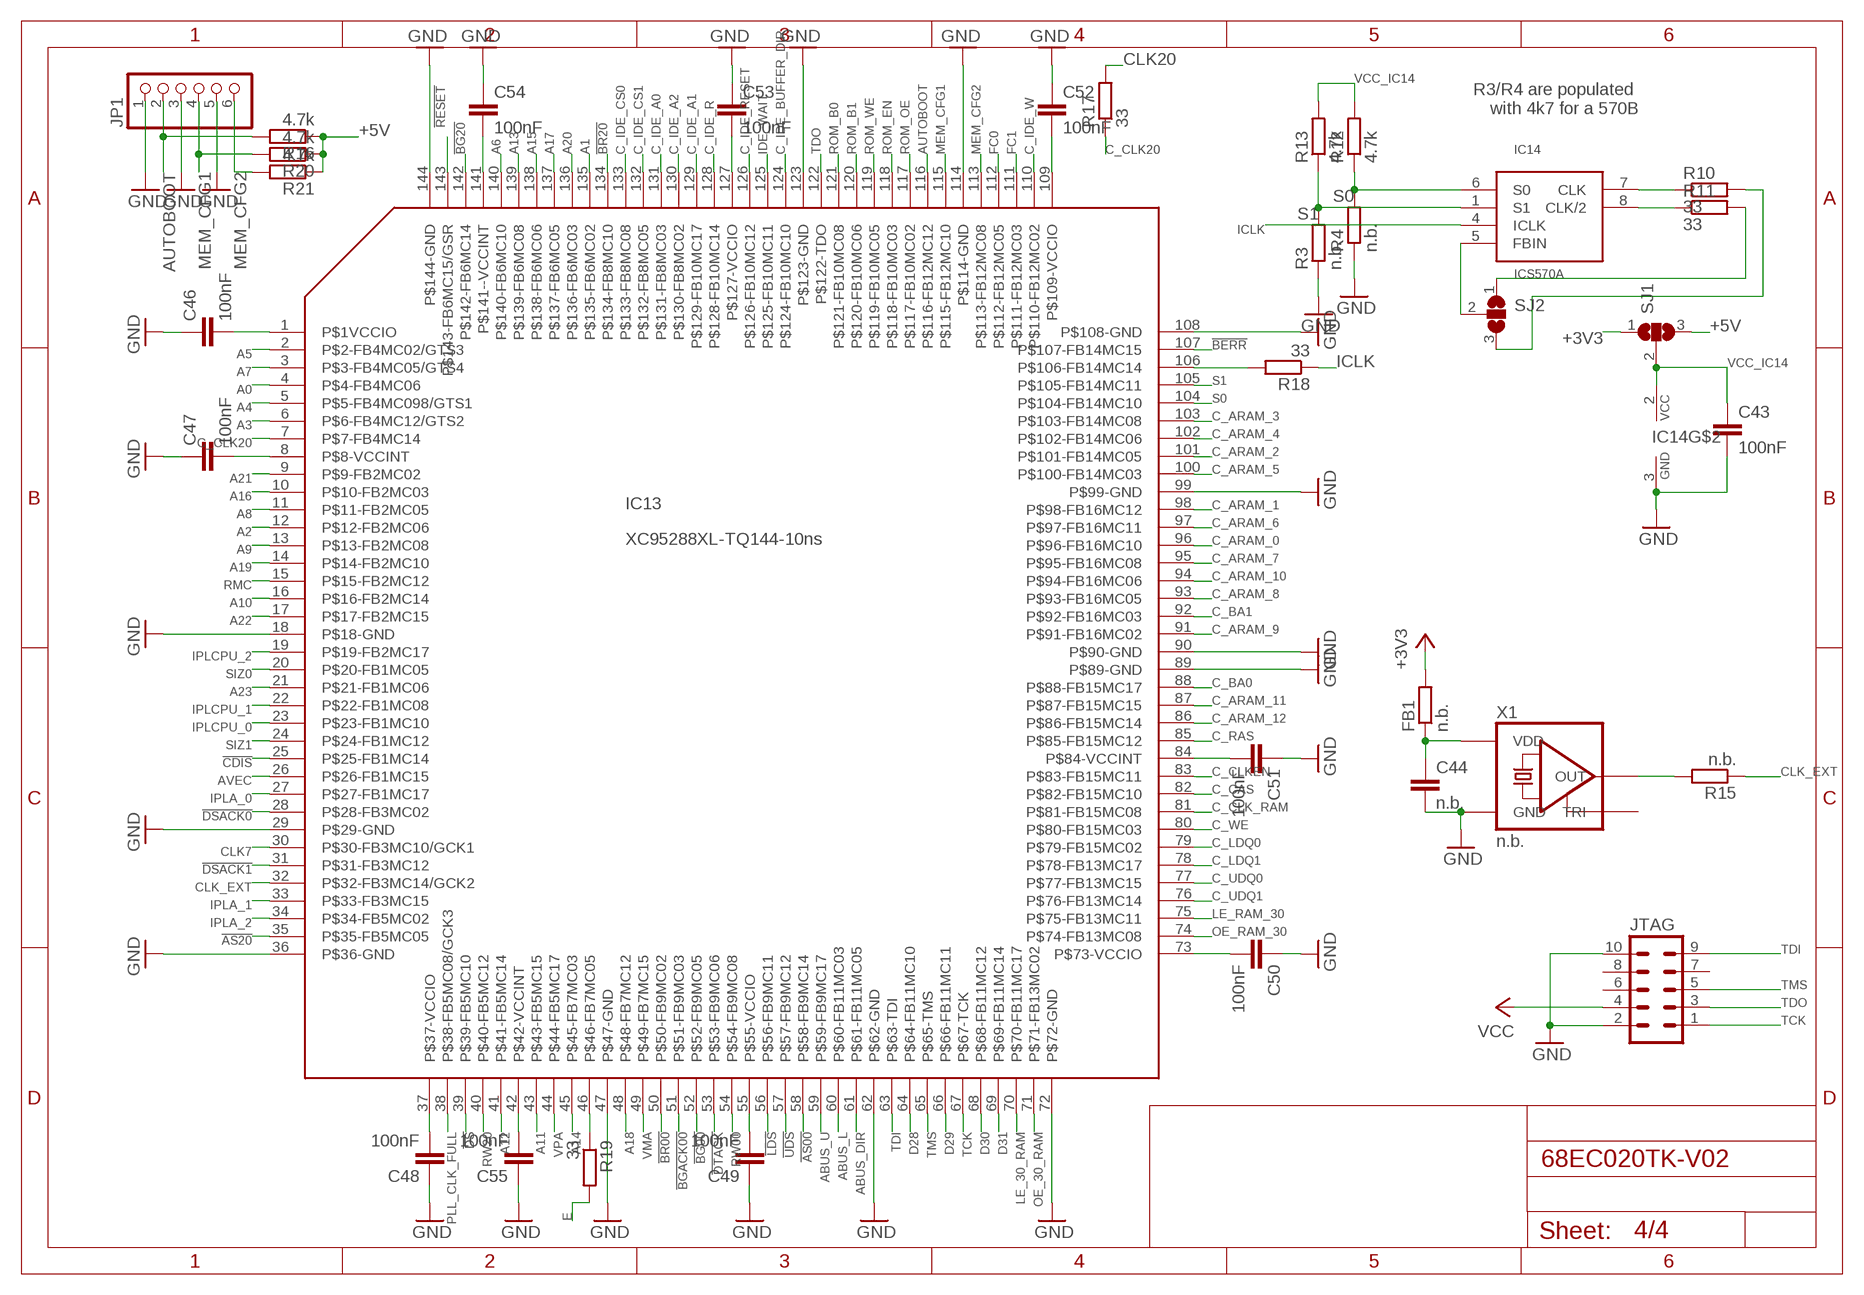
[diagram p3: schematic, sheet 4]

### Parts
C43  100nF  C-EUC0603K  [C0603K]
C44  n.b.  C-EUC0603K  [C0603K]
C46  100nF  C-EUC0603K  [C0603K]
C47  100nF  C-EUC0603K  [C0603K]
C48  100nF  C-EUC0603K  [C0603K]
C49  100nF  C-EUC0603K  [C0603K]
C50  100nF  C-EUC0603K  [C0603K]
C51  100nF  C-EUC0603K  [C0603K]
C52  100nF  C-EUC0603K  [C0603K]
C53  100nF  C-EUC0603K  [C0603K]
C54  100nF  C-EUC0603K  [C0603K]
C55  100nF  C-EUC0603K  [C0603K]
FB1  n.b.  R-EU_R0603  [R0603]
IC13  XC95288XL-TQ144-10ns  XC95288XL-TQ144  [TQFP144]
IC14  ICS570A  ICS570B  [SO-8]
JP1  PINHD-1X6/90  [1X06/90]
JTAG  ML10  [ML10]
R3  n.b.  R-EU_R0603  [R0603]
R4  n.b.  R-EU_R0603  [R0603]
R10  33  R-EU_R0603  [R0603]
R11  33  R-EU_R0603  [R0603]
R12  4.7k  R-EU_R0603  [R0603]
R13  4.7k  R-EU_R0603  [R0603]
R15  n.b.  R-EU_R0603  [R0603]
R16  4.7k  R-EU_R0603  [R0603]
R17  33  R-EU_R0603  [R0603]
R18  33  R-EU_R0603  [R0603]
R19  33  R-EU_R0603  [R0603]
R20  4.7k  R-EU_R0603  [R0603]
R21  4.7k  R-EU_R0603  [R0603]
SJ1  SJ2W  [SJ_2]
SJ2  SJ2W  [SJ_2]
X1  n.b.  CSX-750FCFC(5V)  [7X5]

### Nets
!AS00: IC13.58(P$58-FB9MC14) ; also sheet 1
!AS20: IC13.35(P$35-FB5MC05) ; also sheet 1
!BERR: IC13.107(P$107-FB14MC15) ; also sheet 1
!BG00: IC13.52(P$52-FB9MC05) ; also sheet 1
!BG20: IC13.142(P$142-FB6MC14) ; also sheet 1
!BGACK00: IC13.51(P$51-FB9MC03) ; also sheet 1
!BR00: IC13.50(P$50-FB9MC02) ; also sheet 1
!BR20: IC13.134(P$134-FB8MC10) ; also sheet 1
!CDIS: IC13.25(P$25-FB1MC14) ; also sheet 1
!DS: IC13.39(P$39-FB5MC10) ; also sheet 1
!DSACK0: IC13.28(P$28-FB3MC02) ; also sheet 1
!DSACK1: IC13.31(P$31-FB3MC12) ; also sheet 1
!DTACK: IC13.53(P$53-FB9MC06) ; also sheet 1
!LDS: IC13.56(P$56-FB9MC11) ; also sheet 1
!RESET: IC13.143(P$143-FB6MC15/GSR) ; also sheet 1
!UDS: IC13.57(P$57-FB9MC12) ; also sheet 1
+3V3: C46.2 C47.2 C48.2 C49.2 C50.2 C51.2 C52.2 C53.2 C54.2 C55.2 FB1.2 IC13.1(P$1VCCIO) IC13.8(P$8-VCCINT) IC13.37(P$37-VCCIO) IC13.42(P$42-VCCINT) IC13.55(P$55-VCCIO) IC13.73(P$73-VCCIO) IC13.84(P$84-VCCINT) IC13.109(P$109-VCCIO) IC13.127(P$127-VCCIO) IC13.141(P$141--VCCINT) SJ1.1 ; also sheet 1,2
+5V: JTAG.4 R16.1 R20.1 R21.1 SJ1.3 ; supply symbol labelled VCC ; also sheet 1,3
A0: IC13.4(P$4-FB4MC06) ; also sheet 1
A1: IC13.135(P$135-FB6MC02) ; also sheet 1,3
A2: IC13.12(P$12-FB2MC06) ; also sheet 1,3
A3: IC13.6(P$6-FB4MC12/GTS2) ; also sheet 1,3
A4: IC13.5(P$5-FB4MC098/GTS1) ; also sheet 1,3
A5: IC13.2(P$2-FB4MC02/GTS3) ; also sheet 1,3
A6: IC13.140(P$140-FB6MC10) ; also sheet 1,3
A7: IC13.3(P$3-FB4MC05/GTS4) ; also sheet 1,3
A8: IC13.11(P$11-FB2MC05) ; also sheet 1,3
A9: IC13.13(P$13-FB2MC08) ; also sheet 1,3
A10: IC13.16(P$16-FB2MC14) ; also sheet 1,3
A11: IC13.43(P$43-FB5MC15) ; also sheet 1,3
A12: IC13.41(P$41-FB5MC14) ; also sheet 1,3
A13: IC13.139(P$139-FB6MC08) ; also sheet 1,3
A14: IC13.45(P$45-FB7MC03) ; also sheet 1,3
A15: IC13.138(P$138-FB6MC06) ; also sheet 1,3
A16: IC13.10(P$10-FB2MC03) ; also sheet 1,3
A17: IC13.137(P$137-FB6MC05) ; also sheet 1,3
A18: IC13.48(P$48-FB7MC12) ; also sheet 1
A19: IC13.14(P$14-FB2MC10) ; also sheet 1
A20: IC13.136(P$136-FB6MC03) ; also sheet 1
A21: IC13.9(P$9-FB2MC02) ; also sheet 1
A22: IC13.17(P$17-FB2MC15) ; also sheet 1
A23: IC13.21(P$21-FB1MC06) ; also sheet 1
ABUS_DIR: IC13.61(P$61-FB11MC05) ; also sheet 1
ABUS_L: IC13.60(P$60-FB11MC03) ; also sheet 1
ABUS_U: IC13.59(P$59-FB9MC17) ; also sheet 1
AUTOBOOT: IC13.116(P$116-FB12MC12) JP1.2 R16.2
AVEC: IC13.26(P$26-FB1MC15) ; also sheet 1
C_ARAM_0: IC13.96(P$96-FB16MC10) ; also sheet 2
C_ARAM_1: IC13.98(P$98-FB16MC12) ; also sheet 2
C_ARAM_2: IC13.101(P$101-FB14MC05) ; also sheet 2
C_ARAM_3: IC13.103(P$103-FB14MC08) ; also sheet 2
C_ARAM_4: IC13.102(P$102-FB14MC06) ; also sheet 2
C_ARAM_5: IC13.100(P$100-FB14MC03) ; also sheet 2
C_ARAM_6: IC13.97(P$97-FB16MC11) ; also sheet 2
C_ARAM_7: IC13.95(P$95-FB16MC08) ; also sheet 2
C_ARAM_8: IC13.93(P$93-FB16MC05) ; also sheet 2
C_ARAM_9: IC13.91(P$91-FB16MC02) ; also sheet 2
C_ARAM_10: IC13.94(P$94-FB16MC06) ; also sheet 2
C_ARAM_11: IC13.87(P$87-FB15MC15) ; also sheet 2
C_ARAM_12: IC13.86(P$86-FB15MC14) ; also sheet 2
C_BA0: IC13.88(P$88-FB15MC17) ; also sheet 2
C_BA1: IC13.92(P$92-FB16MC03) ; also sheet 2
C_CAS: IC13.82(P$82-FB15MC10) ; also sheet 2
C_CLK20: IC13.7(P$7-FB4MC14) R17.1
C_CLK_RAM: IC13.81(P$81-FB15MC08) ; also sheet 2
C_CLKEN: IC13.83(P$83-FB15MC11) ; also sheet 2
C_IDE_A0: IC13.131(P$131-FB8MC03) ; also sheet 3
C_IDE_A1: IC13.129(P$129-FB10MC17) ; also sheet 3
C_IDE_A2: IC13.130(P$130-FB8MC02) ; also sheet 3
C_IDE_BUFFER_DIR: IC13.124(P$124-FB10MC10) ; also sheet 3
C_IDE_CS0: IC13.133(P$133-FB8MC08) ; also sheet 3
C_IDE_CS1: IC13.132(P$132-FB8MC05) ; also sheet 3
C_IDE_R: IC13.128(P$128-FB10MC14) ; also sheet 3
C_IDE_RESET: IC13.126(P$126-FB10MC12) ; also sheet 3
C_IDE_W: IC13.110(P$110-FB12MC02) ; also sheet 3
C_LDQ0: IC13.79(P$79-FB15MC02) ; also sheet 2
C_LDQ1: IC13.78(P$78-FB13MC17) ; also sheet 2
C_RAS: IC13.85(P$85-FB15MC12) ; also sheet 2
C_UDQ0: IC13.77(P$77-FB13MC15) ; also sheet 2
C_UDQ1: IC13.76(P$76-FB13MC14) ; also sheet 2
C_WE: IC13.80(P$80-FB15MC03) ; also sheet 2
CLK7: IC13.30(P$30-FB3MC10/GCK1) ; also sheet 1
CLK20: R17.2 ; also sheet 1
CLK_EXT: IC13.32(P$32-FB3MC14/GCK2) R15.1
D28: IC13.64(P$64-FB11MC10) ; also sheet 1,2,3
D29: IC13.66(P$66-FB11MC11) ; also sheet 1,2,3
D30: IC13.68(P$68-FB11MC12) ; also sheet 1,2,3
D31: IC13.69(P$69-FB11MC14) ; also sheet 1,2,3
E: R19.2 ; also sheet 1
FC0: IC13.112(P$112-FB12MC05) ; also sheet 1
FC1: IC13.111(P$111-FB12MC03) ; also sheet 1
GND: C43.2 C44.2 C46.1 C47.1 C48.1 C49.1 C50.1 C51.1 C52.1 C53.1 C54.1 C55.1 IC13.18(P$18-GND) IC13.29(P$29-GND) IC13.36(P$36-GND) IC13.47(P$47-GND) IC13.62(P$62-GND) IC13.72(P$72-GND) IC13.89(P$89-GND) IC13.90(P$90-GND) IC13.99(P$99-GND) IC13.108(P$108-GND) IC13.114(P$114-GND) IC13.123(P$123-GND) IC13.144(P$144-GND) IC14.3(GND) JP1.1 JP1.3 JP1.5 JTAG.2 JTAG.10 R3.1 R4.1 X1.P$2(GND) ; also sheet 1,2,3
ICLK: IC14.4(ICLK) R18.1
IDE_WAIT: IC13.125(P$125-FB10MC11) ; also sheet 3
IPLA_0: IC13.27(P$27-FB1MC17) ; also sheet 1
IPLA_1: IC13.33(P$33-FB3MC15) ; also sheet 1
IPLA_2: IC13.34(P$34-FB5MC02) ; also sheet 1
IPLCPU_0: IC13.23(P$23-FB1MC10) ; also sheet 1
IPLCPU_1: IC13.22(P$22-FB1MC08) ; also sheet 1
IPLCPU_2: IC13.19(P$19-FB2MC17) ; also sheet 1
LE_30_RAM: IC13.70(P$70-FB11MC17) ; also sheet 2
LE_RAM_30: IC13.75(P$75-FB13MC11) ; also sheet 2
MEM_CFG1: IC13.115(P$115-FB12MC10) JP1.4 R20.2
MEM_CFG2: IC13.113(P$113-FB12MC08) JP1.6 R21.2
N$3: IC13.106(P$106-FB14MC14) R18.2
N$4: IC14.7(CLK) R10.1
N$5: IC14.8(CLK/2) R11.1
N$6: IC13.46(P$46-FB7MC05) R19.1
N$8: IC14.5(FBIN) SJ2.2
N$39: R15.2 X1.P$3(OUT)
OE_30_RAM: IC13.71(P$71-FB13MC02) ; also sheet 2
OE_RAM_30: IC13.74(P$74-FB13MC08) ; also sheet 2
PLL_CLK_FULL: IC13.38(P$38-FB5MC08/GCK3) R10.2 SJ2.3
PLL_CLK_HALF: R11.2 SJ2.1
RMC: IC13.15(P$15-FB2MC12) ; also sheet 1
ROM_B0: IC13.121(P$121-FB10MC08) ; also sheet 3
ROM_B1: IC13.120(P$120-FB10MC06) ; also sheet 3
ROM_EN: IC13.118(P$118-FB10MC03) ; also sheet 3
ROM_OE: IC13.117(P$117-FB10MC02) ; also sheet 3
ROM_WE: IC13.119(P$119-FB10MC05) ; also sheet 3
RW00: IC13.54(P$54-FB9MC08) ; also sheet 1
RW20: IC13.40(P$40-FB5MC12) ; also sheet 1
S0: IC13.104(P$104-FB14MC10) IC14.6(S0) R4.2 R12.1
S1: IC13.105(P$105-FB14MC11) IC14.1(S1) R3.2 R13.1
SIZ0: IC13.20(P$20-FB1MC05) ; also sheet 1
SIZ1: IC13.24(P$24-FB1MC12) ; also sheet 1
TCK: IC13.67(P$67-TCK) JTAG.1
TDI: IC13.63(P$63-TDI) JTAG.9
TDO: IC13.122(P$122-TDO) JTAG.3
TMS: IC13.65(P$65-TMS) JTAG.5
VCC-X: C44.1 FB1.1 X1.P$4(VDD)
VCC_IC14: C43.1 IC14.2(VCC) R12.2 R13.2 SJ1.2
VMA: IC13.49(P$49-FB7MC15) ; also sheet 1
VPA: IC13.44(P$44-FB5MC17) ; also sheet 1
Unconnected: JTAG.6 JTAG.7 JTAG.8 X1.P$1(TRI)

### Notes on the sheet
- R3/R4 are populated 
  with 4k7 for a 570B

## Library data of the parts
C1-C57 = rcl:C-EU: CAPACITOR, European symbol
F1 FB1 R1-R4 R10-R13 R15-R21 = rcl:R-EU_: RESISTOR, European symbol
IC1 = micro-mc68000:MC68000P: 68xxx PROCESSOR
IC2 = micro-mc68000:MC68EC020RP
IC3 IC4 = 74xx-eu:74*16245
IC5 = v-reg:LD117A?*: Low drop fixed and adjustable positive voltage regulators 1 A Source: http://www.st.com/stonline/products/literature/ds/7194/ld1117axx.pdf
IC6 IC7 = SMD-IC:ABT16543@2
IC8 IC9 = SMD-IC:K4S56163@2
IC10 IC11 IC15 = 74xx-eu:74*245: Octal BUS TRANSCEIVER, 3-state
IC12 = am29-memory:AM29F010S: 1-Megabit FLASH MEMORY (128 K x 8 bit) 5 V-only
IC13 = xilinx_xc9572xl-tq100:XC95288XL-TQ144
IC14 = IDT:ICS570: Multiplier with FBIN=CLK/2: S1 S0 CLK 0 0 Tristate 0 nc x6 0 1 x8 nc 0 x16 nc nc x12 nc 1 x20 1 0 x2 1 nc x32 1 1 x4; SUPPLY: 3.3V
IDE = con-harting-ml:ML40: HARTING; OC_FARNELL: unknown; OC_NEWARK: unknown
IDE_ACT = con-molex:22-?-02: CONNECTOR wire to board 2.54 mm (.1 inch) pitch header; OC_FARNELL: 9731601; OC_NEWARK: unknown
JP1 = pinhead:PINHD-1X6: PIN HEADER
JTAG = con-harting-ml:ML10: HARTING; OC_FARNELL: unknown; OC_NEWARK: unknown
RN1-RN6 = SMD:R-NETZ@3
SJ1 SJ2 = jumper:SJ2W: SMD solder JUMPER
X1 = SMD-Crystal:CSX-750FC: CITIZEN Crystal Clock Oscilator from http://cfm.citizen.co.jp/english/product/pdf/CSX-750F.pdf